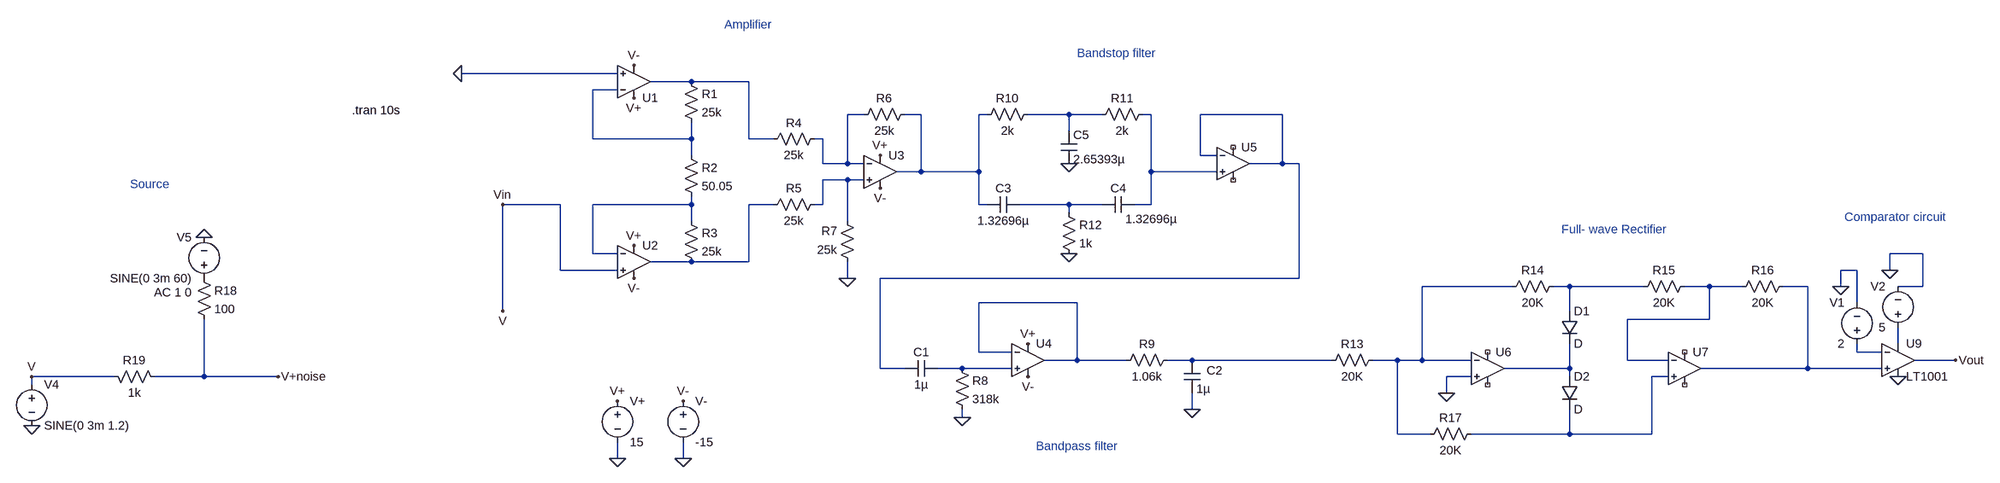
[diagram p0: schematic Heartbeat monitoring system.asc]
Heartbeat monitoring system.asc, the LTspice schematic file:
Version 4.1
SHEET 1 2988 1156
WIRE 224 384 -80 384
WIRE 368 400 288 400
WIRE 480 400 368 400
WIRE 224 416 176 416
WIRE 704 464 672 464
WIRE 816 464 784 464
WIRE 944 464 928 464
WIRE 1104 464 1024 464
WIRE 1168 464 1104 464
WIRE 1264 464 1248 464
WIRE 1520 464 1360 464
WIRE 1104 496 1104 464
WIRE 176 512 176 416
WIRE 368 512 368 480
WIRE 368 512 176 512
WIRE 480 512 480 400
WIRE 528 512 480 512
WIRE 624 512 608 512
WIRE 368 544 368 512
WIRE 1360 544 1360 464
WIRE 1392 544 1360 544
WIRE 624 560 624 512
WIRE 672 560 672 464
WIRE 672 560 624 560
WIRE 704 560 672 560
WIRE 1520 560 1520 464
WIRE 1520 560 1456 560
WIRE 1552 560 1520 560
WIRE 816 576 816 464
WIRE 816 576 768 576
WIRE 928 576 928 464
WIRE 928 576 816 576
WIRE 1264 576 1264 464
WIRE 1392 576 1264 576
WIRE 672 592 624 592
WIRE 704 592 672 592
WIRE 112 640 0 640
WIRE 368 640 368 624
WIRE 368 640 176 640
WIRE 528 640 480 640
WIRE 624 640 624 592
WIRE 624 640 608 640
WIRE 928 640 928 576
WIRE 944 640 928 640
WIRE 1104 640 1008 640
WIRE 1168 640 1104 640
WIRE 1264 640 1264 576
WIRE 1264 640 1232 640
WIRE 1104 656 1104 640
WIRE 368 672 368 640
WIRE 672 672 672 592
WIRE 176 736 176 640
WIRE 224 736 176 736
WIRE 2768 736 2704 736
WIRE 368 752 288 752
WIRE 480 752 480 640
WIRE 480 752 368 752
WIRE 112 768 112 640
WIRE 224 768 112 768
WIRE 2640 768 2608 768
WIRE 2704 768 2704 736
WIRE 672 784 672 752
WIRE 1552 784 1552 560
WIRE 1552 784 736 784
WIRE 1968 800 1792 800
WIRE 2080 800 2048 800
WIRE 2224 800 2080 800
WIRE 2352 800 2304 800
WIRE 2416 800 2352 800
WIRE 2544 800 2496 800
WIRE 2608 800 2608 768
WIRE 2768 800 2768 736
WIRE 2768 800 2720 800
WIRE 1120 832 928 832
WIRE 2640 832 2640 768
WIRE 0 848 0 640
WIRE 2080 848 2080 800
WIRE 2352 864 2352 800
WIRE 2352 864 2192 864
WIRE 2720 912 2720 880
WIRE 928 928 928 832
WIRE 992 928 928 928
WIRE 2640 928 2640 912
WIRE 2688 928 2640 928
WIRE 1120 944 1120 832
WIRE 1120 944 1056 944
WIRE 1216 944 1120 944
WIRE 1344 944 1296 944
WIRE 1616 944 1344 944
WIRE 1744 944 1696 944
WIRE 1792 944 1792 800
WIRE 1792 944 1744 944
WIRE 1888 944 1792 944
WIRE 2192 944 2192 864
WIRE 2272 944 2192 944
WIRE 2832 944 2752 944
WIRE 736 960 736 784
WIRE 784 960 736 960
WIRE 896 960 848 960
WIRE 992 960 896 960
WIRE 2080 960 2080 912
WIRE 2080 960 1952 960
WIRE 2544 960 2544 800
WIRE 2544 960 2336 960
WIRE 2688 960 2544 960
WIRE -816 976 -976 976
WIRE -640 976 -640 864
WIRE -640 976 -736 976
WIRE -496 976 -640 976
WIRE 1888 976 1840 976
WIRE 2080 976 2080 960
WIRE 2272 976 2240 976
WIRE -976 992 -976 976
WIRE 1840 1008 1840 976
WIRE 1344 1040 1344 1008
WIRE 896 1056 896 1040
WIRE 1744 1088 1744 944
WIRE 1808 1088 1744 1088
WIRE 2080 1088 2080 1040
WIRE 2080 1088 1888 1088
WIRE 2240 1088 2240 976
WIRE 2240 1088 2080 1088
WIRE 224 1136 224 1104
WIRE 352 1136 352 1104
FLAG 224 1136 0
FLAG 352 1136 0
FLAG 224 1024 V+
FLAG 352 1024 V-
FLAG 672 784 0
FLAG 256 432 V+
FLAG 736 544 V+
FLAG 736 608 V-
FLAG 256 720 V+
FLAG 256 784 V-
FLAG 256 368 V-
FLAG 896 1056 0
FLAG 1344 1040 0
FLAG 1024 912 V+
FLAG 1024 976 V-
FLAG 1104 560 0
FLAG 1104 736 0
FLAG 2832 944 Vout
FLAG 1840 1008 0
FLAG 2608 800 0
FLAG 2720 976 0
FLAG 2704 768 0
FLAG 0 640 Vin
FLAG -80 384 0
FLAG -640 704 0
FLAG -976 1072 0
FLAG -496 976 V+noise
FLAG -976 976 V
FLAG 0 848 V
SYMBOL voltage 224 1008 R0
WINDOW 123 0 0 Left 0
WINDOW 39 0 0 Left 0
SYMATTR InstName V+
SYMATTR Value 15
SYMBOL voltage 352 1008 R0
WINDOW 123 0 0 Left 0
WINDOW 39 0 0 Left 0
SYMATTR InstName V-
SYMATTR Value -15
SYMBOL OpAmps\\UniversalOpAmp 256 752 R0
SYMATTR InstName U2
SYMBOL res 352 384 R0
SYMATTR InstName R1
SYMATTR Value 25k
SYMBOL res 352 656 R0
SYMATTR InstName R3
SYMATTR Value 25k
SYMBOL res 352 528 R0
SYMATTR InstName R2
SYMATTR Value 50.05
SYMBOL res 624 496 R90
WINDOW 0 0 56 VBottom 2
WINDOW 3 32 56 VTop 2
SYMATTR InstName R4
SYMATTR Value 25k
SYMBOL res 624 624 R90
WINDOW 0 0 56 VBottom 2
WINDOW 3 32 56 VTop 2
SYMATTR InstName R5
SYMATTR Value 25k
SYMBOL OpAmps\\UniversalOpAmp 736 576 R0
SYMATTR InstName U3
SYMBOL res 800 448 R90
WINDOW 0 0 56 VBottom 2
WINDOW 3 32 56 VTop 2
SYMATTR InstName R6
SYMATTR Value 25k
SYMBOL res 688 768 R180
WINDOW 0 36 76 Left 2
WINDOW 3 36 40 Left 2
SYMATTR InstName R7
SYMATTR Value 25k
SYMBOL OpAmps\\UniversalOpAmp 256 400 M180
SYMATTR InstName U1
SYMBOL cap 848 944 R90
WINDOW 0 0 32 VBottom 2
WINDOW 3 32 32 VTop 2
SYMATTR InstName C1
SYMATTR Value 1µ
SYMBOL res 880 944 R0
SYMATTR InstName R8
SYMATTR Value 318k
SYMBOL OpAmps\\UniversalOpAmp 1024 944 R0
SYMATTR InstName U4
SYMBOL res 1312 928 R90
WINDOW 0 0 56 VBottom 2
WINDOW 3 32 56 VTop 2
SYMATTR InstName R9
SYMATTR Value 1.06k
SYMBOL cap 1328 944 R0
WINDOW 0 44 20 Left 2
SYMATTR InstName C2
SYMATTR Value 1µ
SYMBOL res 1040 448 R90
WINDOW 0 0 56 VBottom 2
WINDOW 3 32 56 VTop 2
SYMATTR InstName R10
SYMATTR Value 2k
SYMBOL res 1264 448 R90
WINDOW 0 0 56 VBottom 2
WINDOW 3 32 56 VTop 2
SYMATTR InstName R11
SYMATTR Value 2k
SYMBOL cap 1008 624 R90
WINDOW 0 0 32 VBottom 2
WINDOW 3 32 32 VTop 2
SYMATTR InstName C3
SYMATTR Value 1.32696µ
SYMBOL cap 1232 624 R90
WINDOW 0 0 32 VBottom 2
WINDOW 3 29 -33 VTop 2
SYMATTR InstName C4
SYMATTR Value 1.32696µ
SYMBOL cap 1088 496 R0
SYMATTR InstName C5
SYMATTR Value 2.65393µ
SYMBOL res 1088 640 R0
SYMATTR InstName R12
SYMATTR Value 1k
SYMBOL OpAmps\\UniversalOpAmp 1424 560 R0
SYMATTR InstName U5
SYMBOL OpAmps\\UniversalOpAmp 1920 960 R0
SYMATTR InstName U6
SYMBOL OpAmps\\UniversalOpAmp 2304 960 R0
SYMATTR InstName U7
SYMBOL res 1712 928 R90
WINDOW 0 0 56 VBottom 2
WINDOW 3 32 56 VTop 2
SYMATTR InstName R13
SYMATTR Value 20K
SYMBOL res 2064 784 R90
WINDOW 0 0 56 VBottom 2
WINDOW 3 32 56 VTop 2
SYMATTR InstName R14
SYMATTR Value 20K
SYMBOL res 2320 784 R90
WINDOW 0 0 56 VBottom 2
WINDOW 3 32 56 VTop 2
SYMATTR InstName R15
SYMATTR Value 20K
SYMBOL res 2512 784 R90
WINDOW 0 0 56 VBottom 2
WINDOW 3 32 56 VTop 2
SYMATTR InstName R16
SYMATTR Value 20K
SYMBOL res 1904 1072 R90
WINDOW 0 0 56 VBottom 2
WINDOW 3 32 56 VTop 2
SYMATTR InstName R17
SYMATTR Value 20K
SYMBOL diode 2064 848 R0
SYMATTR InstName D1
SYMBOL diode 2064 976 R0
SYMATTR InstName D2
SYMBOL voltage 2640 928 R180
WINDOW 0 24 96 Left 2
WINDOW 3 24 16 Left 2
WINDOW 123 0 0 Left 0
WINDOW 39 0 0 Left 0
SYMATTR InstName V1
SYMATTR Value 2
SYMBOL OpAmps\\LT1001 2720 880 R0
SYMATTR InstName U9
SYMBOL voltage 2720 896 R180
WINDOW 0 24 96 Left 2
WINDOW 3 24 16 Left 2
WINDOW 123 0 0 Left 0
WINDOW 39 0 0 Left 0
SYMATTR InstName V2
SYMATTR Value 5
SYMBOL voltage -976 976 R0
WINDOW 123 24 124 Left 2
WINDOW 39 0 0 Left 0
SYMATTR InstName V4
SYMATTR Value SINE(0 3m 1.2)
SYMBOL voltage -640 800 R180
WINDOW 0 24 96 Left 2
WINDOW 3 24 16 Left 2
WINDOW 123 24 -12 Left 2
WINDOW 39 0 0 Left 0
SYMATTR InstName V5
SYMATTR Value SINE(0 3m 60)
SYMATTR Value2 AC 1 0
SYMBOL res -656 768 R0
SYMATTR InstName R18
SYMATTR Value 100
SYMBOL res -832 960 M90
WINDOW 0 0 56 VBottom 2
WINDOW 3 32 56 VTop 2
SYMATTR InstName R19
SYMATTR Value 1k
TEXT -352 456 Left 2 !.tran 10s
TEXT -784 600 Left 2 ;Source
TEXT 432 288 Left 2 ;Amplifier
TEXT 1120 344 Left 2 ;Bandstop filter
TEXT 1040 1112 Left 2 ;Bandpass filter
TEXT 2064 688 Left 2 ;Full- wave Rectifier
TEXT 2616 664 Left 2 ;Comparator circuit

The netlist it stands for:
* Heartbeat monitoring system.asc
V+ V+ 0 15
V- V- 0 -15
X§U2 V N009 V+ V- N010 level1 Avol=1Meg GBW=10Meg Vos=0 En=0 Enk=0 In=0 Ink=0 Rin=500Meg  ; pins In+ In- V+ V- OUT
R1 N001 N002 25k
R3 N009 N010 25k
R2 N002 N009 50.05
R4 N003 N001 25k
R5 N008 N010 25k
X§U3 N008 N003 V+ V- N004 level1 Avol=1Meg GBW=10Meg Vos=0 En=0 Enk=0 In=0 Ink=0 Rin=500Meg  ; pins In+ In- V+ V- OUT
R6 N004 N003 25k
R7 0 N008 25k
X§U1 0 N002 V+ V- N001 level1 Avol=1Meg GBW=10Meg Vos=0 En=0 Enk=0 In=0 Ink=0 Rin=500Meg  ; pins In+ In- V+ V- OUT
C1 N020 N007 1µ
R8 N020 0 318k
X§U4 N020 N016 V+ V- N016 level1 Avol=1Meg GBW=10Meg Vos=0 En=0 Enk=0 In=0 Ink=0 Rin=500Meg  ; pins In+ In- V+ V- OUT
R9 N019 N016 1.06k
C2 N019 0 1µ
R10 N005 N004 2k
R11 N006 N005 2k
C3 N011 N004 1.32696µ
C4 N006 N011 1.32696µ
C5 N005 0 2.65393µ
R12 N011 0 1k
X§U5 N006 N007 NC_01 NC_02 N007 level1 Avol=1Meg GBW=10Meg Vos=0 En=0 Enk=0 In=0 Ink=0 Rin=500Meg  ; pins In+ In- V+ V- OUT
X§U6 0 N012 NC_03 NC_04 N021 level1 Avol=1Meg GBW=10Meg Vos=0 En=0 Enk=0 In=0 Ink=0 Rin=500Meg  ; pins In+ In- V+ V- OUT
X§U7 N022 N014 NC_05 NC_06 N015 level1 Avol=1Meg GBW=10Meg Vos=0 En=0 Enk=0 In=0 Ink=0 Rin=500Meg  ; pins In+ In- V+ V- OUT
R13 N012 N019 20K
R14 N013 N012 20K
R15 N014 N013 20K
R16 N015 N014 20K
R17 N022 N012 20K
D1 N013 N021 D
D2 N021 N022 D
V1 N018 0 2
X§U9 N015 N018 N017 0 Vout LT1001  ; pins In+ In- V+ V- OUT
V2 N017 0 5
V4 V 0 SINE(0 3m 1.2)
V5 P001 0 SINE(0 3m 60) AC 1 0
R18 P001 V+noise 100
R19 V V+noise 1k
.model D D
.lib standard.dio
.tran 10s
* Source
* Amplifier
* Bandstop filter
* Bandpass filter
* Full- wave Rectifier
* Comparator circuit
.lib UniversalOpAmp1.lib
.lib LTC.lib
.backanno
.end